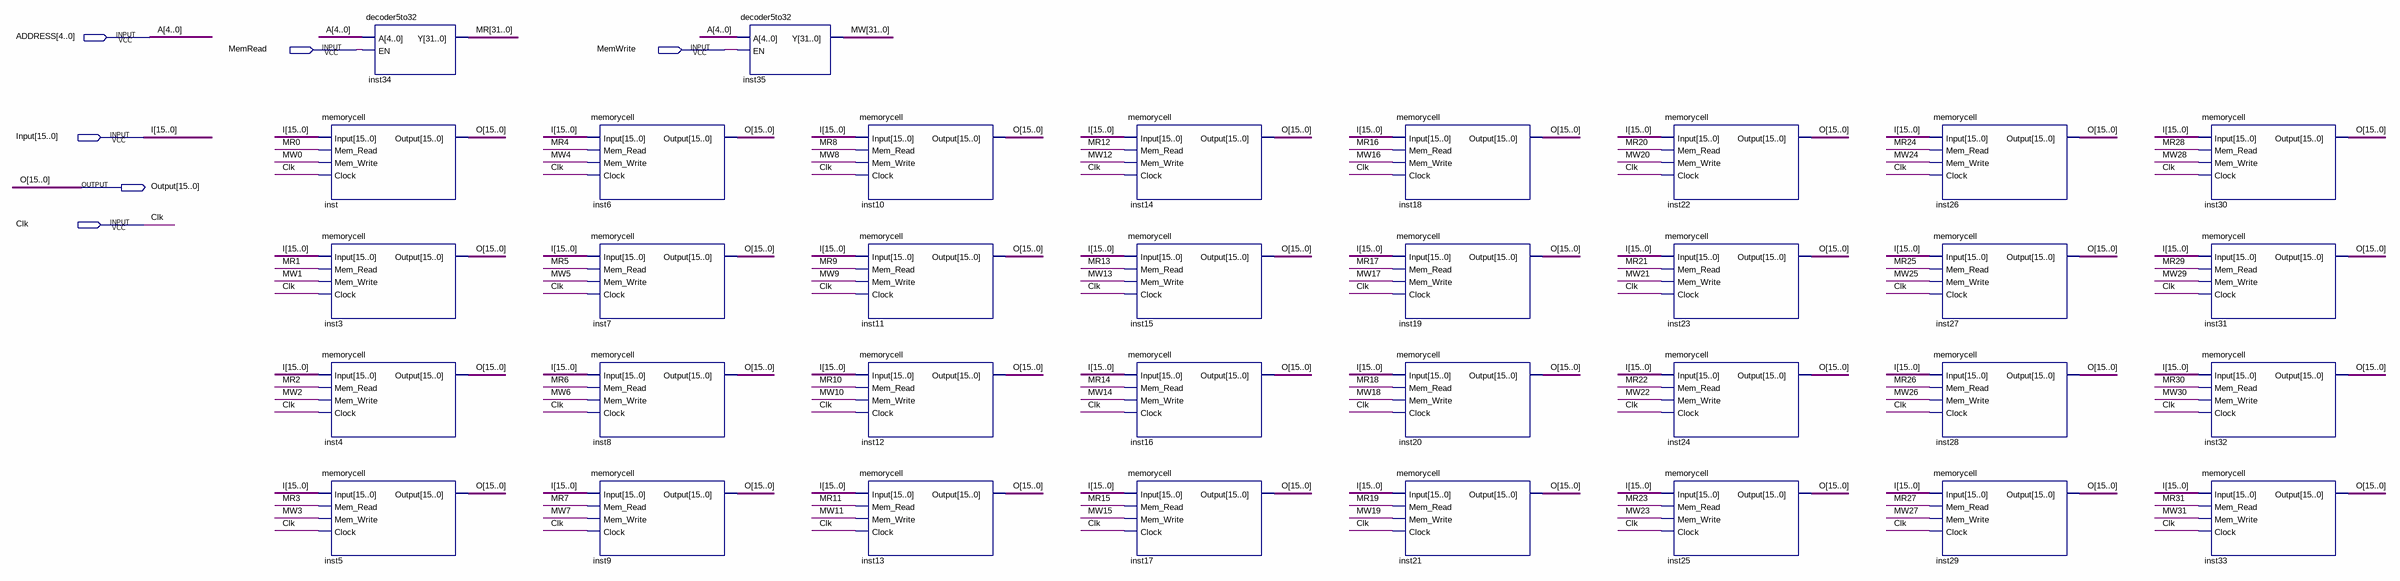
[diagram p0: schematic sheet]
// Quartus schematic Dmem32X16.bdf as structural Verilog: 34 symbols, 6 pins
module Dmem32X16 (
  input  [4:0] ADDRESS,
  input  MemRead,
  input  MemWrite,
  input  [15:0] Input,
  input  Clk,
  output [15:0] Output
);

  wire [31:0] MR, MW;

  memorycell inst (.Input(Input), .Mem_Read(MR[0]), .Mem_Write(MW[0]), .Clock(Clk), .Output(Output));
  memorycell inst3 (.Input(Input), .Mem_Read(MR[1]), .Mem_Write(MW[1]), .Clock(Clk), .Output(Output));
  memorycell inst4 (.Input(Input), .Mem_Read(MR[2]), .Mem_Write(MW[2]), .Clock(Clk), .Output(Output));
  memorycell inst5 (.Input(Input), .Mem_Read(MR[3]), .Mem_Write(MW[3]), .Clock(Clk), .Output(Output));
  decoder5to32 inst34 (.A(ADDRESS), .EN(MemRead), .Y(MR));
  memorycell inst6 (.Input(Input), .Mem_Read(MR[4]), .Mem_Write(MW[4]), .Clock(Clk), .Output(Output));
  memorycell inst7 (.Input(Input), .Mem_Read(MR[5]), .Mem_Write(MW[5]), .Clock(Clk), .Output(Output));
  memorycell inst8 (.Input(Input), .Mem_Read(MR[6]), .Mem_Write(MW[6]), .Clock(Clk), .Output(Output));
  memorycell inst9 (.Input(Input), .Mem_Read(MR[7]), .Mem_Write(MW[7]), .Clock(Clk), .Output(Output));
  decoder5to32 inst35 (.A(ADDRESS), .EN(MemWrite), .Y(MW));
  memorycell inst10 (.Input(Input), .Mem_Read(MR[8]), .Mem_Write(MW[8]), .Clock(Clk), .Output(Output));
  memorycell inst11 (.Input(Input), .Mem_Read(MR[9]), .Mem_Write(MW[9]), .Clock(Clk), .Output(Output));
  memorycell inst12 (.Input(Input), .Mem_Read(MR[10]), .Mem_Write(MW[10]), .Clock(Clk), .Output(Output));
  memorycell inst13 (.Input(Input), .Mem_Read(MR[11]), .Mem_Write(MW[11]), .Clock(Clk), .Output(Output));
  memorycell inst14 (.Input(Input), .Mem_Read(MR[12]), .Mem_Write(MW[12]), .Clock(Clk), .Output(Output));
  memorycell inst15 (.Input(Input), .Mem_Read(MR[13]), .Mem_Write(MW[13]), .Clock(Clk), .Output(Output));
  memorycell inst16 (.Input(Input), .Mem_Read(MR[14]), .Mem_Write(MW[14]), .Clock(Clk), .Output(Output));
  memorycell inst17 (.Input(Input), .Mem_Read(MR[15]), .Mem_Write(MW[15]), .Clock(Clk), .Output(Output));
  memorycell inst18 (.Input(Input), .Mem_Read(MR[16]), .Mem_Write(MW[16]), .Clock(Clk), .Output(Output));
  memorycell inst19 (.Input(Input), .Mem_Read(MR[17]), .Mem_Write(MW[17]), .Clock(Clk), .Output(Output));
  memorycell inst20 (.Input(Input), .Mem_Read(MR[18]), .Mem_Write(MW[18]), .Clock(Clk), .Output(Output));
  memorycell inst21 (.Input(Input), .Mem_Read(MR[19]), .Mem_Write(MW[19]), .Clock(Clk), .Output(Output));
  memorycell inst22 (.Input(Input), .Mem_Read(MR[20]), .Mem_Write(MW[20]), .Clock(Clk), .Output(Output));
  memorycell inst23 (.Input(Input), .Mem_Read(MR[21]), .Mem_Write(MW[21]), .Clock(Clk), .Output(Output));
  memorycell inst24 (.Input(Input), .Mem_Read(MR[22]), .Mem_Write(MW[22]), .Clock(Clk), .Output(Output));
  memorycell inst25 (.Input(Input), .Mem_Read(MR[23]), .Mem_Write(MW[23]), .Clock(Clk), .Output(Output));
  memorycell inst26 (.Input(Input), .Mem_Read(MR[24]), .Mem_Write(MW[24]), .Clock(Clk), .Output(Output));
  memorycell inst27 (.Input(Input), .Mem_Read(MR[25]), .Mem_Write(MW[25]), .Clock(Clk), .Output(Output));
  memorycell inst28 (.Input(Input), .Mem_Read(MR[26]), .Mem_Write(MW[26]), .Clock(Clk), .Output(Output));
  memorycell inst29 (.Input(Input), .Mem_Read(MR[27]), .Mem_Write(MW[27]), .Clock(Clk), .Output(Output));
  memorycell inst30 (.Input(Input), .Mem_Read(MR[28]), .Mem_Write(MW[28]), .Clock(Clk), .Output(Output));
  memorycell inst31 (.Input(Input), .Mem_Read(MR[29]), .Mem_Write(MW[29]), .Clock(Clk), .Output(Output));
  memorycell inst32 (.Input(Input), .Mem_Read(MR[30]), .Mem_Write(MW[30]), .Clock(Clk), .Output(Output));
  memorycell inst33 (.Input(Input), .Mem_Read(MR[31]), .Mem_Write(MW[31]), .Clock(Clk), .Output(Output));

  // Other names for the same wires on the sheet: A[4:0] = ADDRESS; I[15:0] = Input; O[15:0] = Output
endmodule
